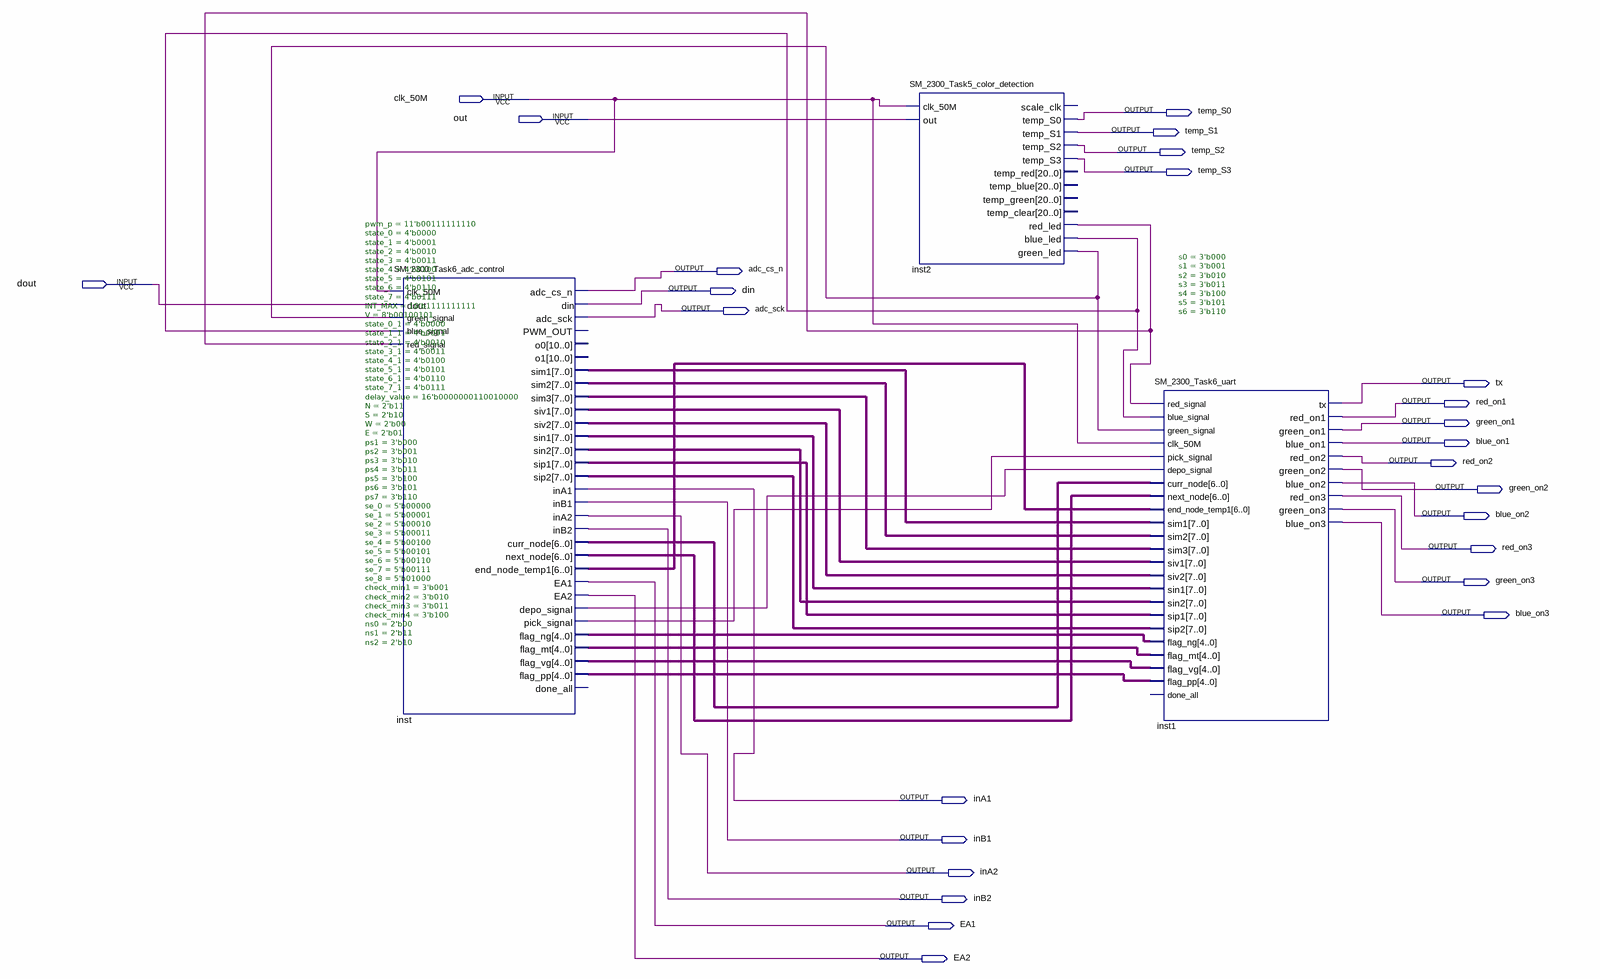
[diagram p0: schematic sheet]
// Quartus schematic SM_2300_Task6_final_bdf.bdf as structural Verilog: 3 symbols, 26 pins
module SM_2300_Task6_final_bdf (
  input  clk_50M,
  input  out,
  input  dout,
  output temp_S0,
  output temp_S1,
  output temp_S2,
  output temp_S3,
  output adc_cs_n,
  output din,
  output adc_sck,
  output tx,
  output red_on1,
  output green_on1,
  output blue_on1,
  output red_on2,
  output green_on2,
  output blue_on2,
  output red_on3,
  output green_on3,
  output blue_on3,
  output inA1,
  output inB1,
  output inA2,
  output inB2,
  output EA1,
  output EA2
);

  wire inst2_blue_led, inst2_green_led, inst2_red_led, inst_depo_signal, inst_pick_signal;
  wire [4:0] inst_flag_mt, inst_flag_ng, inst_flag_pp, inst_flag_vg;
  wire [6:0] inst_curr_node, inst_end_node_temp1, inst_next_node;
  wire [7:0] inst_sim1, inst_sim2, inst_sim3, inst_sin1, inst_sin2, inst_sip1, inst_sip2, inst_siv1,
       inst_siv2;

  SM_2300_Task6_adc_control #(.pwm_p(11'b00111111110), .state_0(4'b0000), .state_1(4'b0001), .state_2(4'b0010), .state_3(4'b0011), .state_4(4'b0100), .state_5(4'b0101), .state_6(4'b0110), .state_7(4'b0111), .INT_MAX(10'b1111111111), .V(8'b00100101), .state_0_1(4'b0000), .state_1_1(4'b0001), .state_2_1(4'b0010), .state_3_1(4'b0011), .state_4_1(4'b0100), .state_5_1(4'b0101), .state_6_1(4'b0110), .state_7_1(4'b0111), .delay_value(16'b0000000110010000), .N(2'b11), .S(2'b10), .W(2'b00), .E(2'b01), .ps1(3'b000), .ps2(3'b001), .ps3(3'b010), .ps4(3'b011), .ps5(3'b100), .ps6(3'b101), .ps7(3'b110), .se_0(5'b00000), .se_1(5'b00001), .se_2(5'b00010), .se_3(5'b00011), .se_4(5'b00100), .se_5(5'b00101), .se_6(5'b00110), .se_7(5'b00111), .se_8(5'b01000), .check_min1(3'b001), .check_min2(3'b010), .check_min3(3'b011), .check_min4(3'b100), .ns0(2'b00), .ns1(2'b11), .ns2(2'b10)) inst (
    .clk_50M(clk_50M), .dout(dout), .green_signal(inst2_green_led), .blue_signal(inst2_blue_led),
    .red_signal(inst2_red_led), .adc_cs_n(adc_cs_n), .din(din), .adc_sck(adc_sck), .sim1(inst_sim1),
    .sim2(inst_sim2), .sim3(inst_sim3), .siv1(inst_siv1), .siv2(inst_siv2), .sin1(inst_sin1),
    .sin2(inst_sin2), .sip1(inst_sip1), .sip2(inst_sip2), .inA1(inA1), .inB1(inB1), .inA2(inA2), .inB2(inB2),
    .curr_node(inst_curr_node), .next_node(inst_next_node), .end_node_temp1(inst_end_node_temp1), .EA1(EA1),
    .EA2(EA2), .depo_signal(inst_depo_signal), .pick_signal(inst_pick_signal), .flag_ng(inst_flag_ng),
    .flag_mt(inst_flag_mt), .flag_vg(inst_flag_vg), .flag_pp(inst_flag_pp));  // open: PWM_OUT, o0, o1, done_all
  SM_2300_Task5_color_detection inst2 (
    .clk_50M(clk_50M), .out(out), .temp_S0(temp_S0), .temp_S1(temp_S1), .temp_S2(temp_S2), .temp_S3(temp_S3),
    .red_led(inst2_red_led), .blue_led(inst2_blue_led), .green_led(inst2_green_led));  // open: scale_clk, temp_red, temp_blue, temp_green, temp_clear
  SM_2300_Task6_uart #(.s0(3'b000), .s1(3'b001), .s2(3'b010), .s3(3'b011), .s4(3'b100), .s5(3'b101), .s6(3'b110)) inst1 (
    .red_signal(inst2_red_led), .blue_signal(inst2_blue_led), .green_signal(inst2_green_led),
    .clk_50M(clk_50M), .pick_signal(inst_pick_signal), .depo_signal(inst_depo_signal),
    .curr_node(inst_curr_node), .next_node(inst_next_node), .end_node_temp1(inst_end_node_temp1),
    .sim1(inst_sim1), .sim2(inst_sim2), .sim3(inst_sim3), .siv1(inst_siv1), .siv2(inst_siv2),
    .sin1(inst_sin1), .sin2(inst_sin2), .sip1(inst_sip1), .sip2(inst_sip2), .flag_ng(inst_flag_ng),
    .flag_mt(inst_flag_mt), .flag_vg(inst_flag_vg), .flag_pp(inst_flag_pp), .tx(tx), .red_on1(red_on1),
    .green_on1(green_on1), .blue_on1(blue_on1), .red_on2(red_on2), .green_on2(green_on2),
    .blue_on2(blue_on2), .red_on3(red_on3), .green_on3(green_on3), .blue_on3(blue_on3));  // open: done_all
endmodule
